# EAGLE schematic WeMos-RFM96 (EAGLE 7.5.0)
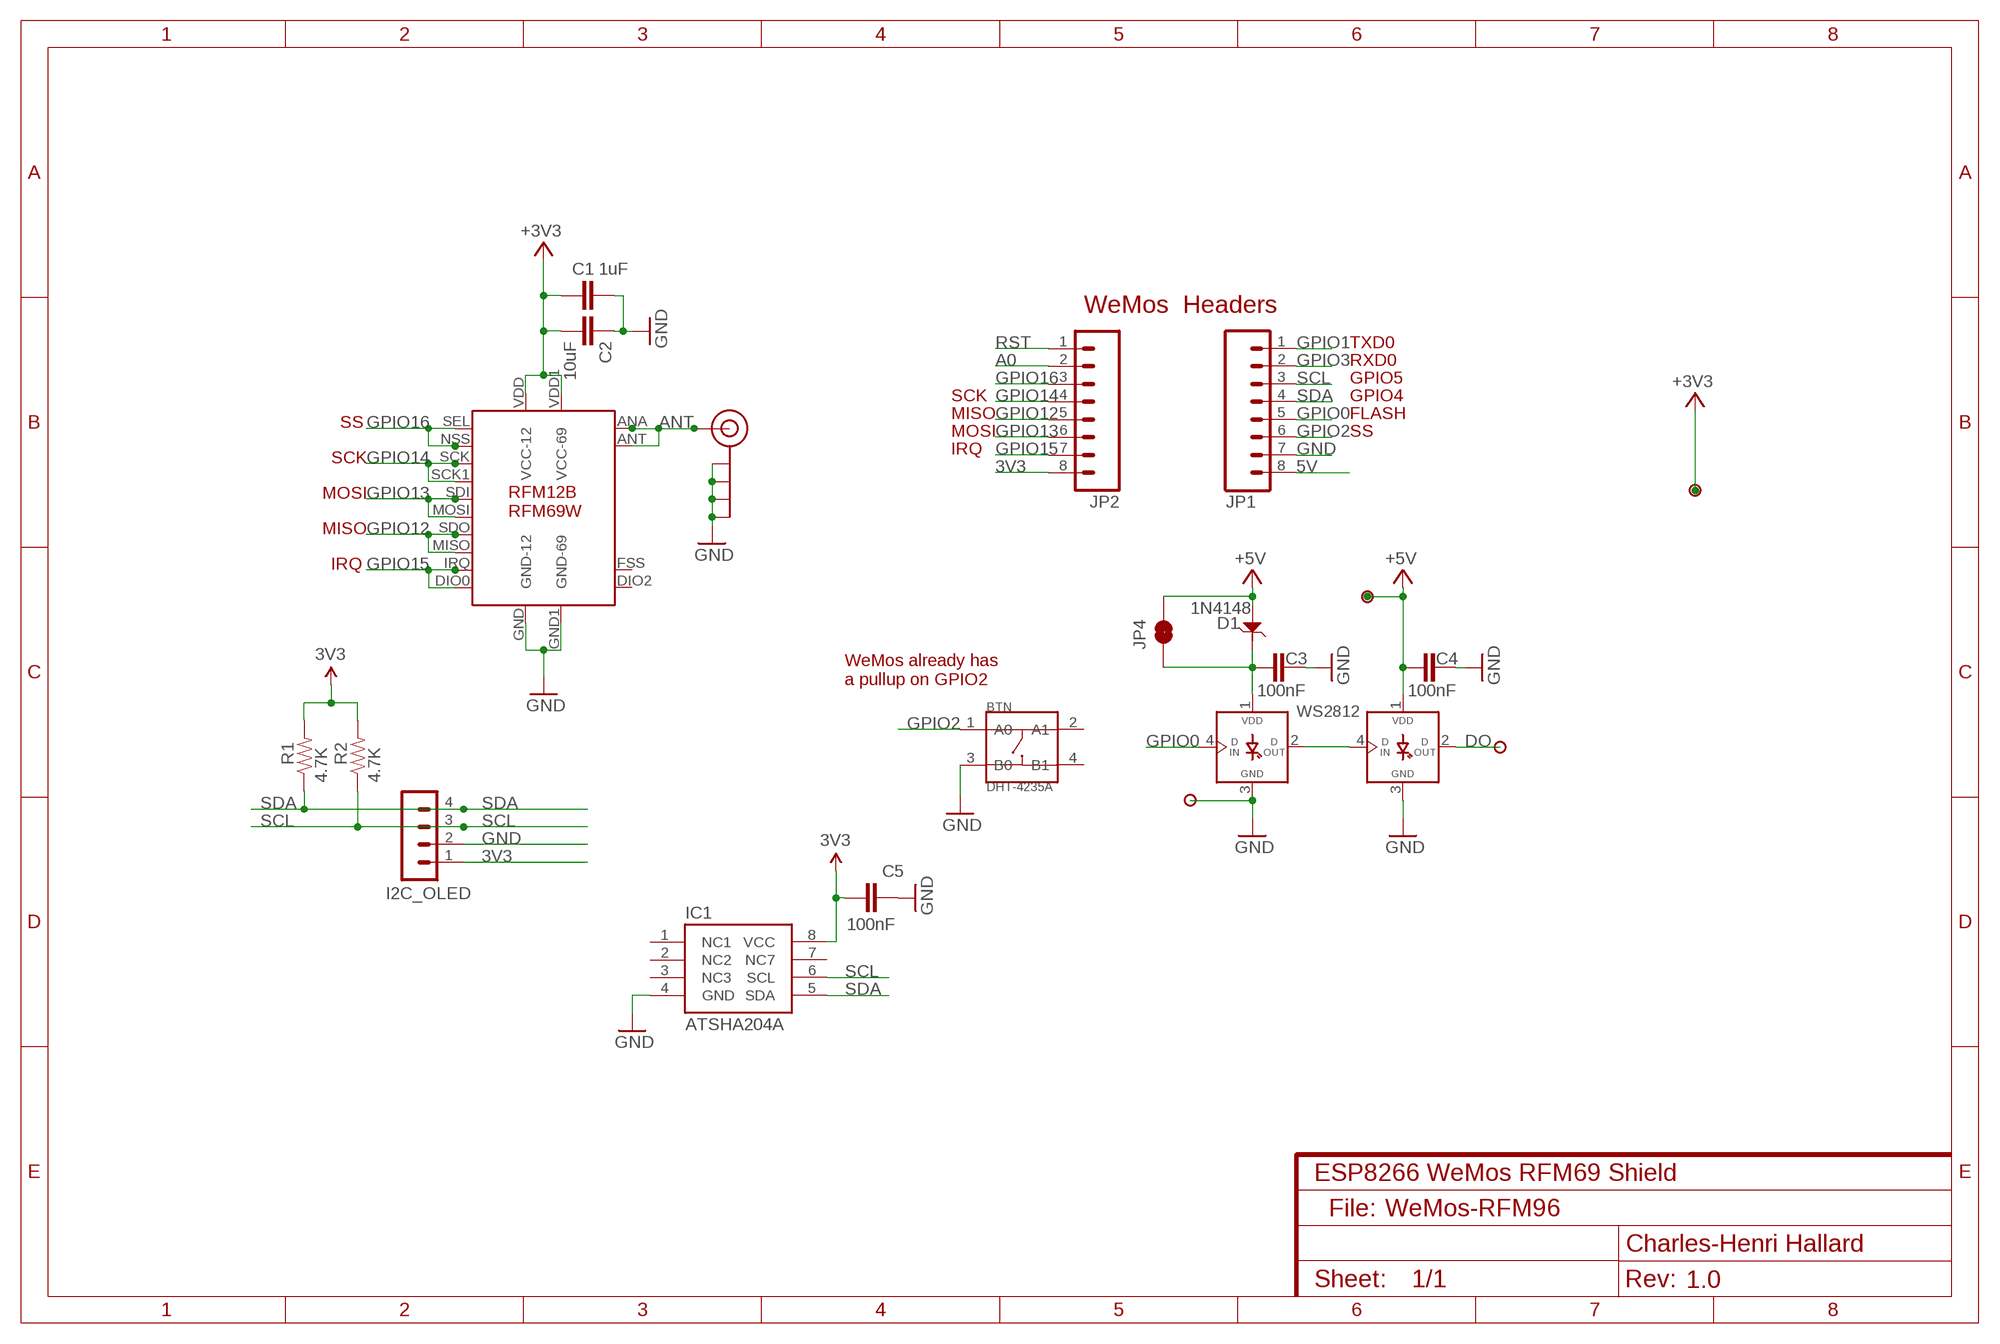
[diagram p0: schematic, sheet 1]
NAME (FRAME-A4L): CNAME: ESP8266 WeMos RFM69 Shield; CREVISION: 1.0; DESIGNER: Charles-Henri Hallard

## Parts
BTN  DHT-4235A  SMD-BUTTON-TOP-DHT-4235A(4P-4.2X3.2MM)  [SW4-SMD-4.2X3.2X2.5MM]
C1  1uF  CAP0805-CAP-LARGEPADS  [0805-CAP-LARGEPADS]
C2  10uF  CAP0805-CAP-LARGEPADS  [0805-CAP-LARGEPADS]
C3  100nF  CAP0805-CAP  [0805-CAP]
C4  100nF  CAP0805-CAP  [0805-CAP]
C5  100nF  CAP0805-CAP  [0805-CAP]
D1  1N4148  D-ESD-2P-CESD5V0D1  [SOD123-2.7X1.6]
I2C_OLED  CON_HEADER_1X04'SMALL''  [M1X4]
IC1  ATSHA204A  ATSHA204_SOIC8  [SOIC8]
J$1  ANTENNASMALL  [SMA_UFL_PAD_SMALL]
JP1  M08NO_SILK_FEMALE_PTH  [1X08_NO_SILK]
JP2  M08NO_SILK_FEMALE_PTH  [1X08_NO_SILK]
JP4  JUMPER-PAD-2-NC_BY_TRACE  [PAD-JUMPER-2-NC_BY_TRACE_YES_SILK]
P1  PADNORMAL  [PAD]
P2  PADNORMAL  [PAD]
P3  PADNORMAL  [PAD]
P4  PADNORMAL  [PAD]
R1  4.7K  RESISTOR0805-RES  [0805-RES]
R2  4.7K  RESISTOR0805-RES  [0805-RES]
U$1  RFM-DUAL  [RFM-DUAL]
WS1  WS2812B  WS2812BSMD  [WS2812B]
WS2812  WS2812B  WS2812BSMD  [WS2812B]

## Nets
3V3: C1.2 C2.2 C5.2 I2C_OLED.1 IC1.8(VCC) JP2.8 P4.1 R1.2 R2.2 U$1.VDD1(VCC-69) U$1.VDD(VCC-12) ; supply symbol labelled +3V3
5V: C4.1 D1.1 JP1.8 JP4.2 P1.1 WS1.1(VDD) ; supply symbol labelled +5V
A0: JP2.2
ANT: J$1.ANT1(SIGNAL) J$1.ANT2(SIGNAL) U$1.ANA(ANT-12) U$1.ANT(ANT-69)
DO: P2.1 WS1.2(DOUT)
GND: BTN.3(B0) C1.1 C2.1 C3.2 C4.2 C5.1 I2C_OLED.2 IC1.4(GND) J$1.GND1(GND) J$1.GND2(GND) J$1.GND3(GND) J$1.GND4(GND) JP1.7 P3.1 U$1.GND1(GND-69) U$1.GND(GND-12) WS1.3(GND) WS2812.3(GND)
GPIO0: JP1.5 WS2812.4(DIN)
GPIO1: JP1.1
GPIO2: BTN.1(A0) JP1.6
GPIO3: JP1.2
GPIO12: JP2.5 U$1.MISO U$1.SDO
GPIO13: JP2.6 U$1.MOSI U$1.SDI
GPIO14: JP2.4 U$1.SCK U$1.SCK1
GPIO15: JP2.7 U$1.DIO0 U$1.IRQ
GPIO16: JP2.3 U$1.NSS(SEL-12) U$1.SEL(SEL-69)
N$1: WS1.4(DIN) WS2812.2(DOUT)
RST: JP2.1
SCL: I2C_OLED.3 IC1.6(SCL) JP1.3 R2.1
SDA: I2C_OLED.4 IC1.5(SDA) JP1.4 R1.1
VLED: C3.1 D1.2 JP4.1 WS2812.1(VDD)
Unconnected: BTN.2(A1) BTN.4(B1) IC1.1(NC1) IC1.2(NC2) IC1.3(NC3) IC1.7(NC7) U$1.DIO2 U$1.FSS(FFS)

## Notes on the sheet
- WeMos  Headers
- TXD0
- RXD0
- GPIO5
- SCK | GPIO4
- MISO | FLASH
- SS
- MOSI | SS
- IRQ
- SCK
- MOSI
- MISO
- IRQ
- WeMos already has
  a pullup on GPIO2
- File:

## Library data of the parts
BTN = Switch-2016:SMD-BUTTON-TOP-DHT-4235A(4P-4.2X3.2MM): 311020045; MPN: DHT-4235A
C1-C5 = _c2h:CAP: Capacitor Standard 0603 ceramic capacitor, and 0.1" leaded capacitor.
D1 = Seeed-Discrete:D-ESD-2P: Diodes for Protectiong against ESD
I2C_OLED = _c2h:CON_HEADER_1X04
IC1 = SparkFun-DigitalIC:ATSHA204_SOIC8: ATSHA204; PROD_ID: IC-11981
J$1 = _c2h:ANTENNA: SMA Antenna Connector End launch SMA connector. The paste layer has been removed so that the connector can be hand soldered onto the board after reflow.
JP1 JP2 = SparkFun-Connectors:M08: Header 8 Standard 8-pin 0.1" header. Use with straight break away headers (SKU : PRT-00116), right angle break away headers (PRT-00553), swiss pins (PRT-00743), machine pins (PRT-00117), and female headers (PRT-00115).; PROD_ID: CONN-08438
JP4 = SparkFun-Passives:JUMPER-PAD-2-NC_BY_TRACE
P1-P4 = _c2h:PAD
R1 R2 = _c2h:RESISTOR: Resistor Basic schematic elements and footprints for 0603, 1206, and PTH resistors.
U$1 = _c2h:RFM-DUAL
WS1 WS2812 = _c2h:WS2812B

## Net classes
0 default: width 0.203 mm, drill 0.356 mm, clearance 0.152 mm
1 power: width 0.203 mm, clearance 0.152 mm